# EAGLE schematic Apollo4-BluePlus-Module_rev_a-v33 (EAGLE 9.7.0)
AUTHOR: Pat Pannuto; REV: A; TITLE: Apollo4-BluePlus-Module

## Sheet 1 of 2: Apollo4 IC
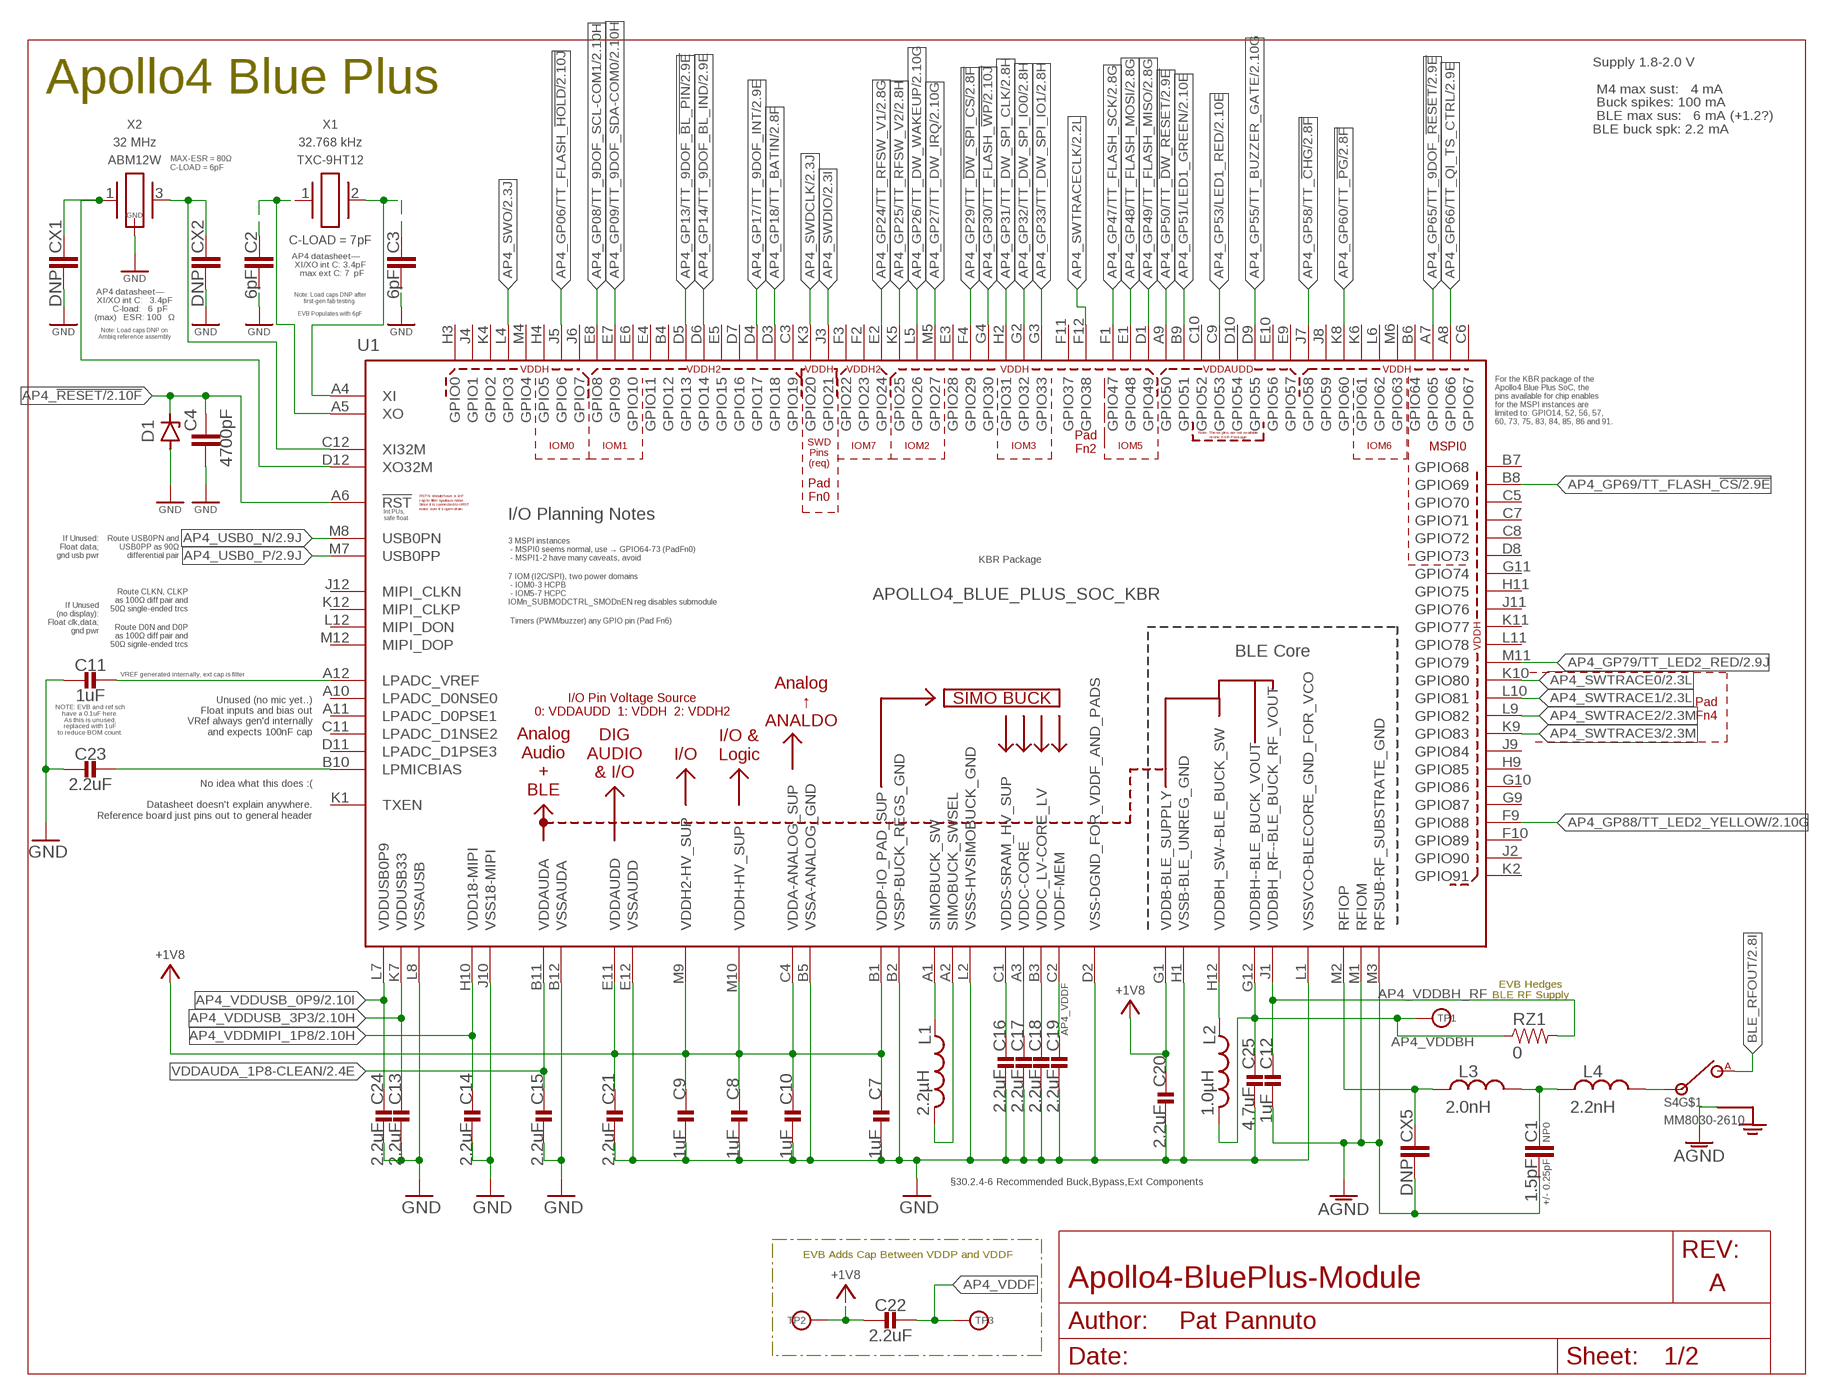
[diagram p0: schematic, sheet 1]

### Parts
C1  1.5pF  C_CHIP-0402(1005-METRIC)  [CAPC1005X60]
C2  6pF  C_CHIP-0402(1005-METRIC)  [CAPC1005X60]
C3  6pF  C_CHIP-0402(1005-METRIC)  [CAPC1005X60]
C4  4700pF  C_CHIP-0402(1005-METRIC)  [CAPC1005X60]
C7  1uF  CAPACITOR0201_CAP  [0201_CAP]
C8  1uF  CAPACITOR0201_CAP  [0201_CAP]
C9  1uF  CAPACITOR0201_CAP  [0201_CAP]
C10  1uF  CAPACITOR0201_CAP  [0201_CAP]
C11  1uF  CAPACITOR0201_CAP  [0201_CAP]
C12  1uF  CAPACITOR0201_CAP  [0201_CAP]
C13  2.2uF  CAPACITOR0201_CAP  [0201_CAP]
C14  2.2uF  CAPACITOR0201_CAP  [0201_CAP]
C15  2.2uF  CAPACITOR0201_CAP  [0201_CAP]
C16  2.2uF  CAPACITOR0201_CAP  [0201_CAP]
C17  2.2uF  CAPACITOR0201_CAP  [0201_CAP]
C18  2.2uF  CAPACITOR0201_CAP  [0201_CAP]
C19  2.2uF  CAPACITOR0201_CAP  [0201_CAP]
C20  2.2uF  CAPACITOR0201_CAP  [0201_CAP]
C21  2.2uF  CAPACITOR0201_CAP  [0201_CAP]
C22  2.2uF  CAPACITOR0201_CAP  [0201_CAP]
C23  2.2uF  CAPACITOR0201_CAP  [0201_CAP]
C24  2.2uF  CAPACITOR0201_CAP  [0201_CAP]
C25  4.7uF  CAPACITOR0402_CAP  [0402_CAP]
CX1  DNP  C_CHIP-0402(1005-METRIC)  [CAPC1005X60]
CX2  DNP  C_CHIP-0402(1005-METRIC)  [CAPC1005X60]
CX5  DNP  C_CHIP-0402(1005-METRIC)  [CAPC1005X60]
D1  ZENER  ZENER_SODFL(1608-METRIC)  [SODFL1608X70]
L1  2.2µH  INDUCTOR0805  [0805_CAP]
L2  1.0µH  INDUCTOR0603  [0603_CAP]
L3  2.0nH  L_CHIP-0402(1006-METRIC)  [INDC1006X60N]
L4  2.2nH  L_CHIP-0402(1006-METRIC)  [INDC1006X60N]
RZ1  0  RESISTOR0402_RES  [0402_RES]
S4  MM8030-2610  [MM8030-2610]
TP1  VDDBH  TEST-POINT  [PAD.03X.03]
TP2  VDDP  TEST-POINT  [PAD.03X.03]
TP3  VDDF  TEST-POINT  [PAD.03X.03]
U1  APOLLO4_BLUE_PLUS_SOC_KBR  [APOLLO4_BLUE_SOC_BGA]
X1  TXC-9HT12  [TXC-9HT12]
X2  ABM12W  [ABM12W]

### Nets
+1V8: C7.P$1 C8.P$1 C9.P$1 C10.P$1 C20.P$1 C21.P$1 C22.P$2 TP2.P$1(TESTPOINT) U1.B1(VDDP-IO_PAD_SUP) U1.C4(VDDA-ANALOG_SUP) U1.E11(VDDAUDD) U1.G1(VDDB-BLE_SUPPLY) U1.M9(VDDH2-HV_SUP) U1.M10(VDDH-HV_SUP) ; also sheet 2
AGND: C1.2 C12.P$2 CX5.2 S4.G1(GND) S4.G2(GND) U1.M1(RFIOM) U1.M3(RFSUB-RF_SUBSTRATE_GND) ; also sheet 2
AP4_!RESET: C4.1 D1.1(C) U1.A6(!RST) ; also sheet 2
AP4_GP06/TT_FLASH_!HOLD: U1.J5(GPIO6) ; also sheet 2
AP4_GP08/TT_9DOF_SCL-COM1: U1.E8(GPIO8) ; also sheet 2
AP4_GP09/TT_9DOF_SDA-COM0: U1.E7(GPIO9) ; also sheet 2
AP4_GP13/TT_9DOF_!BL_PIN: U1.D5(GPIO13) ; also sheet 2
AP4_GP14/TT_9DOF_BL_IND: U1.D6(GPIO14) ; also sheet 2
AP4_GP17/TT_9DOF_INT: U1.D4(GPIO17) ; also sheet 2
AP4_GP18/TT_BATIN: U1.D3(GPIO18) ; also sheet 2
AP4_GP24/TT_RFSW_V1: U1.E2(GPIO24) ; also sheet 2
AP4_GP25/TT_RFSW_V2: U1.K5(GPIO25) ; also sheet 2
AP4_GP26/TT_DW_WAKEUP: U1.L5(GPIO26) ; also sheet 2
AP4_GP27/TT_DW_IRQ: U1.M5(GPIO27) ; also sheet 2
AP4_GP29/TT_!DW_SPI_CS: U1.F4(GPIO29) ; also sheet 2
AP4_GP30/TT_FLASH_!WP: U1.G4(GPIO30) ; also sheet 2
AP4_GP31/TT_DW_SPI_CLK: U1.H2(GPIO31) ; also sheet 2
AP4_GP32/TT_DW_SPI_IO0: U1.G2(GPIO32) ; also sheet 2
AP4_GP33/TT_DW_SPI_IO1: U1.G3(GPIO33) ; also sheet 2
AP4_GP47/TT_FLASH_SCK: U1.F1(GPIO47) ; also sheet 2
AP4_GP48/TT_FLASH_MOSI: U1.E1(GPIO48) ; also sheet 2
AP4_GP49/TT_FLASH_MISO: U1.D1(GPIO49) ; also sheet 2
AP4_GP50/TT_!DW_RESET: U1.A9(GPIO50) ; also sheet 2
AP4_GP51/LED1_GREEN: U1.B9(GPIO51) ; also sheet 2
AP4_GP53/LED1_RED: U1.C9(GPIO53) ; also sheet 2
AP4_GP55/TT_BUZZER_GATE: U1.D9(GPIO55) ; also sheet 2
AP4_GP58/TT_!CHG: U1.J7(GPIO58) ; also sheet 2
AP4_GP60/TT_!PG: U1.K8(GPIO60) ; also sheet 2
AP4_GP65/TT_9DOF_!RESET: U1.A7(GPIO65) ; also sheet 2
AP4_GP66/TT_QI_TS_CTRL: U1.A8(GPIO66) ; also sheet 2
AP4_GP69/TT_FLASH_!CS: U1.B8(GPIO69) ; also sheet 2
AP4_GP79/TT_LED2_RED: U1.M11(GPIO79) ; also sheet 2
AP4_GP88/TT_LED2_YELLOW: U1.F9(GPIO88) ; also sheet 2
AP4_LPADC_VREF: C11.P$2 U1.A12(LPADC_VREF)
AP4_LPMICBIAS: C23.P$2 U1.B10(LPMICBIAS)
AP4_RFIOP [BLE_PHY]: CX5.1 L3.1 U1.M2(RFIOP)
AP4_SWDCLK: U1.K3(GPIO20) ; also sheet 2
AP4_SWDIO: U1.J3(GPIO21) ; also sheet 2
AP4_SWO: U1.L4(GPIO3) ; also sheet 2
AP4_SWTRACE0: U1.K10(GPIO80) ; also sheet 2
AP4_SWTRACE1: U1.L10(GPIO81) ; also sheet 2
AP4_SWTRACE2: U1.L9(GPIO82) ; also sheet 2
AP4_SWTRACE3: U1.K9(GPIO83) ; also sheet 2
AP4_SWTRACECLK: U1.F12(GPIO38) ; also sheet 2
AP4_USB0_N [USB_PHY]: U1.M8(USB0PN) ; also sheet 2
AP4_USB0_P [USB_PHY]: U1.M7(USB0PP) ; also sheet 2
AP4_VDDBH: C25.1 L2.2 RZ1.1 TP1.P$1(TESTPOINT) U1.G12(VDDBH--BLE_BUCK_VOUT)
AP4_VDDBH_RF: C12.P$1 RZ1.2 U1.J1(VDDBH_RF--BLE_BUCK_RF_VOUT)
AP4_VDDBH_SW: L2.1 U1.H12(VDDBH_SW--BLE_BUCK_SW)
AP4_VDDC: C17.P$1 U1.A3(VDDC-CORE)
AP4_VDDC_LV: C18.P$1 U1.B3(VDDC_LV-CORE_LV)
AP4_VDDF: C19.P$1 C22.P$1 TP3.P$1(TESTPOINT) U1.C2(VDDF-MEM)
AP4_VDDMIPI_1P8: C14.P$1 U1.H10(VDD18-MIPI) ; also sheet 2
AP4_VDDS: C16.P$1 U1.C1(VDDS-SRAM_HV_SUP)
AP4_VDDUSB_0P9: C24.P$1 U1.L7(VDDUSB0P9) ; also sheet 2
AP4_VDDUSB_3P3: C13.P$1 U1.K7(VDDUSB33) ; also sheet 2
AP4_XI: C3.1 U1.A4(XI) X1.2
AP4_XI32M: CX2.1 U1.C12(XI32M) X2.3
AP4_XO: C2.1 U1.A5(XO) X1.1
AP4_XO32M: CX1.1 U1.D12(XO32M) X2.1
BLE_RFOUT [BLE_PHY]: S4.OUT(A) ; also sheet 2
GND: C2.2 C3.2 C4.2 C7.P$2 C8.P$2 C9.P$2 C10.P$2 C11.P$1 C13.P$2 C14.P$2 C15.P$2 C16.P$2 C17.P$2 C18.P$2 C19.P$2 C20.P$2 C21.P$2 C23.P$1 C24.P$2 C25.2 CX1.2 CX2.2 D1.2(A) U1.B2(VSSP-BUCK_REGS_GND) U1.B5(VSSA-ANALOG_GND) U1.B12(VSSAUDA) U1.D2(VSS-DGND_FOR_VDDF_AND_PADS) U1.E12(VSSAUDD) U1.H1(VSSB-BLE_UNREG_GND) U1.J10(VSS18-MIPI) U1.L1(VSSVCO-BLECORE_GND_FOR_VCO) U1.L2(VSSS-HVSIMOBUCK_GND) U1.L8(VSSAUSB) X2.2(GND) X2.4(GND) ; also sheet 2
N$17 [BLE_PHY]: C1.1 L3.2 L4.1
N$18 [BLE_PHY]: L4.2 S4.IN
SIMOBUCK_SW: L1.P$1 U1.A1(SIMOBUCK_SW)
SIMOBUCK_SWSEL: L1.P$2 U1.A2(SIMOBUCK_SWSEL)
VDDAUDA_1P8-CLEAN: C15.P$1 U1.B11(VDDAUDA) ; also sheet 2
Unconnected: U1.A10(LPADC_D0NSE0) U1.A11(LPADC_D0PSE1) U1.B4(GPIO12) U1.B6(GPIO64) U1.B7(GPIO68) U1.C3(GPIO19) U1.C5(GPIO70) U1.C6(GPIO67) U1.C7(GPIO71) U1.C8(GPIO72) U1.C10(GPIO52) U1.C11(LPADC_D1NSE2) U1.D7(GPIO16) U1.D8(GPIO73) U1.D10(GPIO54) U1.D11(LPADC_D1PSE3) U1.E3(GPIO28) U1.E4(GPIO11) U1.E5(GPIO15) U1.E6(GPIO10) U1.E9(GPIO57) U1.E10(GPIO56) U1.F2(GPIO23) U1.F3(GPIO22) U1.F10(GPIO89) U1.F11(GPIO37) U1.G9(GPIO87) U1.G10(GPIO86) U1.G11(GPIO74) U1.H3(GPIO0) U1.H4(GPIO5) U1.H9(GPIO85) U1.H11(GPIO75) U1.J2(GPIO90) U1.J4(GPIO1) U1.J6(GPIO7) U1.J8(GPIO59) U1.J9(GPIO84) U1.J11(GPIO76) U1.J12(MIPI_CLKN) U1.K1(TXEN) U1.K2(GPIO91) U1.K4(GPIO2) U1.K6(GPIO61) U1.K11(GPIO77) U1.K12(MIPI_CLKP) U1.L6(GPIO62) U1.L11(GPIO78) U1.L12(MIPI_DON) U1.M4(GPIO4) U1.M6(GPIO63) U1.M12(MIPI_DOP)

### Notes on the sheet
- Apollo4 Blue Plus
- Supply 1.8-2.0 V
  
   M4 max sust:   4 mA
   Buck spikes: 100 mA
   BLE max sus:   6 mA (+1.2?)
  BLE buck spk: 2.2 mA
- AP4 datasheet—    
  XI/XO int C: 3.4pF
    max ext C: 7  pF
- AP4 datasheet—    
  XI/XO int C:   3.4pF
       C-load:   6  pF
  (max)   ESR: 100   Ω
- Note: Load caps DNP after
  first-gen fab testing.
  
  EVB Populates with 6pF
- Note: Load caps DNP on
  Ambiq reference assembly
- For the KBR package of the
  Apollo4 Blue Plus SoC, the
  pins available for chip enables
  for the MSPI instances are
  limited to: GPIO14, 52, 56, 57,
  60, 73, 75, 83, 84, 85, 86 and 91.
- Pad
  Fn2
- MSPI0
- IOM0 | IOM1 | IOM7 | IOM2 | IOM3 | IOM5 | IOM6
- SWD
  Pins
  (req)
- Pad
  Fn0
- Int PUs,
  safe float
- I/O Planning Notes
- 3 MSPI instances
   - MSPI0 seems normal, use → GPIO64-73 (PadFn0)
   - MSPI1-2 have many caveats, avoid
- If Unused:
  Float data;
  gnd usb pwr
- Route USB0PN and
  USB0PP as 90Ω
  differential pair
- KBR Package
- 7 IOM (I2C/SPI), two power domains
   - IOM0-3 HCPB
   - IOM5-7 HCPC
  IOMn_SUBMODCTRL_SMODnEN reg disables submodule
- Route CLKN, CLKP
  as 100Ω diff pair and
  50Ω single-ended trcs
- If Unused
  (no display):
  Float clk,data;
  gnd pwr
- Timers (PWM/buzzer) any GPIO pin (Pad Fn6)
- Route D0N and D0P
  as 100Ω diff pair and
  50Ω signle-ended trcs
- VREF generated internally, ext cap is filter
- NOTE: EVB and ref sch
  have a 0.1uF here.
  As this is unused,
  replaced with 1uF
  to reduce BOM count.
- Pad
  Fn4
- Unused (no mic yet..)
  Float inputs and bias out
  VRef always gen'd internally
  and expects 100nF cap
- No idea what this does :(
  
  Datasheet doesn't explain anywhere.
  Reference board just pins out to general header
- EVB Hedges
  BLE RF Supply
- §30.2.4-6 Recommended Buck,Bypass,Ext Components
- EVB Adds Cap Between VDDP and VDDF

## Sheet 2 of 2: Support Circuits
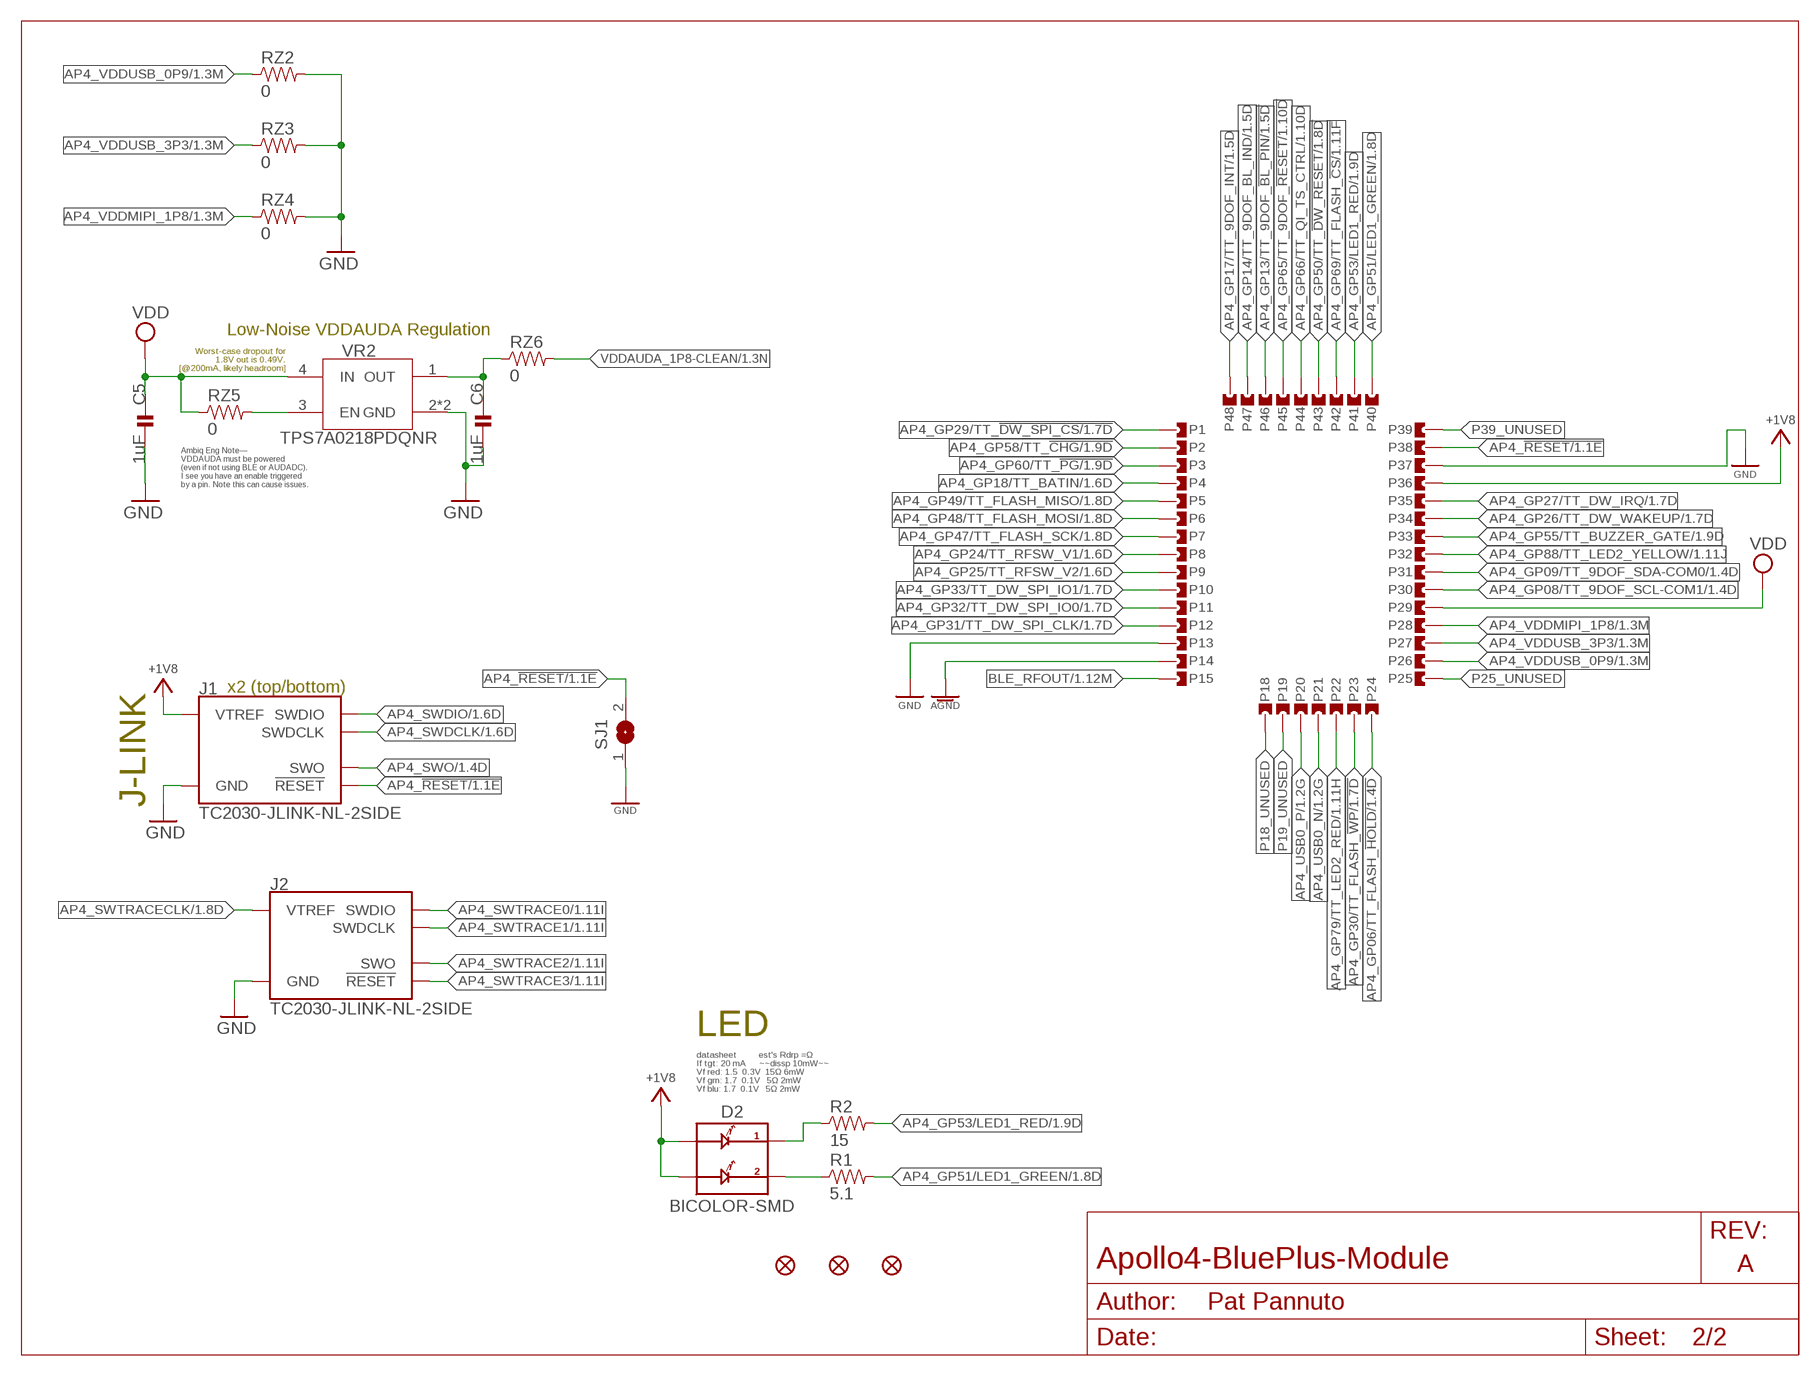
[diagram p1: schematic, sheet 2]

### Parts
C5  1uF  CAPACITOR0201_CAP  [0201_CAP]
C6  1uF  CAPACITOR0201_CAP  [0201_CAP]
D2  BICOLOR-SMD  [LED-0606]
FD1  FIDUCIALUFIDUCIAL  [FIDUCIAL-MICRO]
FD2  FIDUCIALUFIDUCIAL  [FIDUCIAL-MICRO]
FD3  FIDUCIALUFIDUCIAL  [FIDUCIAL-MICRO]
J1  TC2030-JLINK-NL-2SIDE  [TC2030-IDC-NL-2SIDE]
J2  TC2030-JLINK-NL-2SIDE  [TC2030-IDC-NL-2SIDE]
P1  CASTELLATION4L  [CASTELLATION-0.55MM_DRILL-4L]
P2  CASTELLATION4L  [CASTELLATION-0.55MM_DRILL-4L]
P3  CASTELLATION4L  [CASTELLATION-0.55MM_DRILL-4L]
P4  CASTELLATION4L  [CASTELLATION-0.55MM_DRILL-4L]
P5  CASTELLATION4L  [CASTELLATION-0.55MM_DRILL-4L]
P6  CASTELLATION4L  [CASTELLATION-0.55MM_DRILL-4L]
P7  CASTELLATION4L  [CASTELLATION-0.55MM_DRILL-4L]
P8  CASTELLATION4L  [CASTELLATION-0.55MM_DRILL-4L]
P9  CASTELLATION4L  [CASTELLATION-0.55MM_DRILL-4L]
P10  CASTELLATION4L  [CASTELLATION-0.55MM_DRILL-4L]
P11  CASTELLATION4L  [CASTELLATION-0.55MM_DRILL-4L]
P12  CASTELLATION4L  [CASTELLATION-0.55MM_DRILL-4L]
P13  CASTELLATION4L  [CASTELLATION-0.55MM_DRILL-4L]
P14  CASTELLATION4L  [CASTELLATION-0.55MM_DRILL-4L]
P15  CASTELLATION4L  [CASTELLATION-0.55MM_DRILL-4L]
P18  CASTELLATION4L  [CASTELLATION-0.55MM_DRILL-4L]
P19  CASTELLATION4L  [CASTELLATION-0.55MM_DRILL-4L]
P20  CASTELLATION4L  [CASTELLATION-0.55MM_DRILL-4L]
P21  CASTELLATION4L  [CASTELLATION-0.55MM_DRILL-4L]
P22  CASTELLATION4L  [CASTELLATION-0.55MM_DRILL-4L]
P23  CASTELLATION4L  [CASTELLATION-0.55MM_DRILL-4L]
P24  CASTELLATION4L  [CASTELLATION-0.55MM_DRILL-4L]
P25  CASTELLATION4L  [CASTELLATION-0.55MM_DRILL-4L]
P26  CASTELLATION4L  [CASTELLATION-0.55MM_DRILL-4L]
P27  CASTELLATION4L  [CASTELLATION-0.55MM_DRILL-4L]
P28  CASTELLATION4L  [CASTELLATION-0.55MM_DRILL-4L]
P29  CASTELLATION4L  [CASTELLATION-0.55MM_DRILL-4L]
P30  CASTELLATION4L  [CASTELLATION-0.55MM_DRILL-4L]
P31  CASTELLATION4L  [CASTELLATION-0.55MM_DRILL-4L]
P32  CASTELLATION4L  [CASTELLATION-0.55MM_DRILL-4L]
P33  CASTELLATION4L  [CASTELLATION-0.55MM_DRILL-4L]
P34  CASTELLATION4L  [CASTELLATION-0.55MM_DRILL-4L]
P35  CASTELLATION4L  [CASTELLATION-0.55MM_DRILL-4L]
P36  CASTELLATION4L  [CASTELLATION-0.55MM_DRILL-4L]
P37  CASTELLATION4L  [CASTELLATION-0.55MM_DRILL-4L]
P38  CASTELLATION4L  [CASTELLATION-0.55MM_DRILL-4L]
P39  CASTELLATION4L  [CASTELLATION-0.55MM_DRILL-4L]
P40  CASTELLATION4L  [CASTELLATION-0.55MM_DRILL-4L]
P41  CASTELLATION4L  [CASTELLATION-0.55MM_DRILL-4L]
P42  CASTELLATION4L  [CASTELLATION-0.55MM_DRILL-4L]
P43  CASTELLATION4L  [CASTELLATION-0.55MM_DRILL-4L]
P44  CASTELLATION4L  [CASTELLATION-0.55MM_DRILL-4L]
P45  CASTELLATION4L  [CASTELLATION-0.55MM_DRILL-4L]
P46  CASTELLATION4L  [CASTELLATION-0.55MM_DRILL-4L]
P47  CASTELLATION4L  [CASTELLATION-0.55MM_DRILL-4L]
P48  CASTELLATION4L  [CASTELLATION-0.55MM_DRILL-4L]
R1  5.1  RESISTOR0201_RES  [0201_RES]
R2  15  RESISTOR0201_RES  [0201_RES]
RZ2  0  RESISTOR0402_RES  [0402_RES]
RZ3  0  RESISTOR0402_RES  [0402_RES]
RZ4  0  RESISTOR0402_RES  [0402_RES]
RZ5  0  RESISTOR0402_RES  [0402_RES]
RZ6  0  RESISTOR0402_RES  [0402_RES]
SJ1  SJ  [SJ]
VR2  TPS7A0218PDQNR  [4-XDFN-EP]

### Nets
+1V8: D2.A1 D2.A2 J1.1(VTREF) J1.B1(VTREF) P36.P$1 P36.P$2 P36.P$3 ; also sheet 1
AGND: P14.P$1 P14.P$2 P14.P$3 ; also sheet 1
AP4_!RESET: J1.3(!RESET) J1.B3(!RESET) P38.P$1 P38.P$2 P38.P$3 SJ1.2 ; also sheet 1
AP4_GP06/TT_FLASH_!HOLD: P24.P$1 P24.P$2 P24.P$3 ; also sheet 1
AP4_GP08/TT_9DOF_SCL-COM1: P30.P$1 P30.P$2 P30.P$3 ; also sheet 1
AP4_GP09/TT_9DOF_SDA-COM0: P31.P$1 P31.P$2 P31.P$3 ; also sheet 1
AP4_GP13/TT_9DOF_!BL_PIN: P46.P$1 P46.P$2 P46.P$3 ; also sheet 1
AP4_GP14/TT_9DOF_BL_IND: P47.P$1 P47.P$2 P47.P$3 ; also sheet 1
AP4_GP17/TT_9DOF_INT: P48.P$1 P48.P$2 P48.P$3 ; also sheet 1
AP4_GP18/TT_BATIN: P4.P$1 P4.P$2 P4.P$3 ; also sheet 1
AP4_GP24/TT_RFSW_V1: P8.P$1 P8.P$2 P8.P$3 ; also sheet 1
AP4_GP25/TT_RFSW_V2: P9.P$1 P9.P$2 P9.P$3 ; also sheet 1
AP4_GP26/TT_DW_WAKEUP: P34.P$1 P34.P$2 P34.P$3 ; also sheet 1
AP4_GP27/TT_DW_IRQ: P35.P$1 P35.P$2 P35.P$3 ; also sheet 1
AP4_GP29/TT_!DW_SPI_CS: P1.P$1 P1.P$2 P1.P$3 ; also sheet 1
AP4_GP30/TT_FLASH_!WP: P23.P$1 P23.P$2 P23.P$3 ; also sheet 1
AP4_GP31/TT_DW_SPI_CLK: P12.P$1 P12.P$2 P12.P$3 ; also sheet 1
AP4_GP32/TT_DW_SPI_IO0: P11.P$1 P11.P$2 P11.P$3 ; also sheet 1
AP4_GP33/TT_DW_SPI_IO1: P10.P$1 P10.P$2 P10.P$3 ; also sheet 1
AP4_GP47/TT_FLASH_SCK: P7.P$1 P7.P$2 P7.P$3 ; also sheet 1
AP4_GP48/TT_FLASH_MOSI: P6.P$1 P6.P$2 P6.P$3 ; also sheet 1
AP4_GP49/TT_FLASH_MISO: P5.P$1 P5.P$2 P5.P$3 ; also sheet 1
AP4_GP50/TT_!DW_RESET: P43.P$1 P43.P$2 P43.P$3 ; also sheet 1
AP4_GP51/LED1_GREEN: P40.P$1 P40.P$2 P40.P$3 R1.2 ; also sheet 1
AP4_GP53/LED1_RED: P41.P$1 P41.P$2 P41.P$3 R2.2 ; also sheet 1
AP4_GP55/TT_BUZZER_GATE: P33.P$1 P33.P$2 P33.P$3 ; also sheet 1
AP4_GP58/TT_!CHG: P2.P$1 P2.P$2 P2.P$3 ; also sheet 1
AP4_GP60/TT_!PG: P3.P$1 P3.P$2 P3.P$3 ; also sheet 1
AP4_GP65/TT_9DOF_!RESET: P45.P$1 P45.P$2 P45.P$3 ; also sheet 1
AP4_GP66/TT_QI_TS_CTRL: P44.P$1 P44.P$2 P44.P$3 ; also sheet 1
AP4_GP69/TT_FLASH_!CS: P42.P$1 P42.P$2 P42.P$3 ; also sheet 1
AP4_GP79/TT_LED2_RED: P22.P$1 P22.P$2 P22.P$3 ; also sheet 1
AP4_GP88/TT_LED2_YELLOW: P32.P$1 P32.P$2 P32.P$3 ; also sheet 1
AP4_LED2_BLUE_COMM: D2.C1 R2.1
AP4_LED_RED_COMM: D2.C2 R1.1
AP4_SWDCLK: J1.4(SWDCLK) J1.B4(SWDCLK) ; also sheet 1
AP4_SWDIO: J1.2(SWDIO) J1.B2(SWDIO) ; also sheet 1
AP4_SWO: J1.6(SWO) J1.B6(SWO) ; also sheet 1
AP4_SWTRACE0: J2.2(SWDIO) J2.B2(SWDIO) ; also sheet 1
AP4_SWTRACE1: J2.4(SWDCLK) J2.B4(SWDCLK) ; also sheet 1
AP4_SWTRACE2: J2.6(SWO) J2.B6(SWO) ; also sheet 1
AP4_SWTRACE3: J2.3(!RESET) J2.B3(!RESET) ; also sheet 1
AP4_SWTRACECLK: J2.1(VTREF) J2.B1(VTREF) ; also sheet 1
AP4_USB0_N [USB_PHY]: P21.P$1 P21.P$2 P21.P$3 ; also sheet 1
AP4_USB0_P [USB_PHY]: P20.P$1 P20.P$2 P20.P$3 ; also sheet 1
AP4_VDDMIPI_1P8: P28.P$1 P28.P$2 P28.P$3 RZ4.1 ; also sheet 1
AP4_VDDUSB_0P9: P26.P$1 P26.P$2 P26.P$3 RZ2.1 ; also sheet 1
AP4_VDDUSB_3P3: P27.P$1 P27.P$2 P27.P$3 RZ3.1 ; also sheet 1
BLE_RFOUT [BLE_PHY]: P15.P$1 P15.P$2 P15.P$3 ; also sheet 1
GND: C5.P$2 C6.P$2 J1.5(GND) J1.B5(GND) J2.5(GND) J2.B5(GND) P13.P$1 P13.P$2 P13.P$3 P37.P$1 P37.P$2 P37.P$3 RZ2.2 RZ3.2 RZ4.2 SJ1.1 VR2.2(GND) VR2.PAD(GND) ; also sheet 1
P18_UNUSED: P18.P$1 P18.P$2 P18.P$3
P19_UNUSED: P19.P$1 P19.P$2 P19.P$3
P25_UNUSED: P25.P$1 P25.P$2 P25.P$3
P39_UNUSED: P39.P$1 P39.P$2 P39.P$3
VDD: C5.P$1 P29.P$1 P29.P$2 P29.P$3 RZ5.1 VR2.4(IN)
VDDAUDA_1P8-CLEAN: RZ6.2 ; also sheet 1
VR2_EN: RZ5.2 VR2.3(EN)
VR2_OUT: C6.P$1 RZ6.1 VR2.1(OUT)

### Notes on the sheet
- Low-Noise VDDAUDA Regulation
- Worst-case dropout for
  1.8V out is 0.49V.
  [@200mA, likely headroom]
- Ambiq Eng Note—
  VDDAUDA must be powered
  (even if not using BLE or AUDADC).
  I see you have an enable triggered
  by a pin. Note this can cause issues.
- x2 (top/bottom)
- J-LINK
- LED
- datasheet          est's Rdrp =Ω
  If tgt: 20 mA      ~~dissp 10mW~~
  Vf red: 1.5  0.3V  15Ω 6mW
  Vf grn: 1.7  0.1V   5Ω 2mW
  Vf blu: 1.7  0.1V   5Ω 2mW

## Library data of the parts
C1 = Capacitor:C: Capacitor - Generic; CATEGORY: Capacitor; DESCRIPTION: CAP CER 1.5PF 50V C0G/NP0 0402; MANUFACTURER: KEMET; MPN: C0402C159C5GAC7867; TEMPCOEFF: NP0; TOLERANCE: +/- 0.25pF
C2 C3 = Capacitor:C: Capacitor - Generic; CATEGORY: Capacitor; MANUFACTURER: Murata; MPN: GCM1555C1H6R0BA16D
C4 = Capacitor:C: Capacitor - Generic; CATEGORY: Capacitor; MPN: KGM05AR71E472KH
C5-C10 C12 = passives:CAPACITOR: SMD Capacitor; MANUFACTURER: Murata; MPN: GRM033R61A105ME44D
C11 = passives:CAPACITOR: SMD Capacitor; MANUFACTURER: MURATA; MPN: GRM033R61A105ME44D
C13-C24 = passives:CAPACITOR: SMD Capacitor; MANUFACTURER: Murata; MPN: GRM033R61A225KE47D
C25 = passives:CAPACITOR: SMD Capacitor; MPN: CL05A475MP5NRNC
CX1 CX2 CX5 = Capacitor:C: Capacitor - Generic; CATEGORY: Capacitor
D1 = Diode:ZENER: Zener Diode - Generic; CATEGORY: Diode; DESCRIPTION: DIODE TVS 5.5V STANDOFF 8V BREAKDOWN SC79; MANUFACTURER: NXP SEMICONDUCTOR; MPN: PESD5V0X1UB,135; SUB-CATEGORY: Zener
D2 = leds:BICOLOR-SMD; MPN: MCL0606FRD1GR1T
FD1-FD3 = SparkFun-Aesthetics:FIDUCIAL: Fiducial Alignment Points Point-of-reference for pick-and-place machines and other optical instruments.
J1 J2 = connector:TC2030-JLINK
L1 = passives:INDUCTOR: A very specific inductor; MANUFACTURER: Murata; MPN: DFE201210U-2R2M=P2
L2 = passives:INDUCTOR: A very specific inductor; MANUFACTURER: Murata; MPN: DFE18SAN1R0ME0L
L3 = Inductor:L: Inductor Fixed - Generic; CATEGORY: Inductor; DESCRIPTION: FIXED IND 2.0NH0.1NH SMD; MANUFACTURER: Central Technologies; MPN: CTTF0402F-2N0B; SUB-CATEGORY: Fixed; TOLERANCE: +/- 0.1 nH
L4 = Inductor:L: Inductor Fixed - Generic; CATEGORY: Inductor; DESCRIPTION: FIXED IND 2.2NH0.1NH SMD; MANUFACTURER: Central Technologies; MPN: CTTF0402F-2N2B; SUB-CATEGORY: Fixed; TOLERANCE: +/- 0.1 nH
P1-P15 P18-P48 = connector:CASTELLATION: Castellation 0.55 mm drill, 1.27 mm pitch – Matches ESP32
R1 = passives:RESISTOR: Resistor Basic schematic elements and footprints for 0201, 0402, 0603, 1206, and PTH resistors.; MPN: SR731HTTC5R10F; PDISS: 0.002 W
R2 = passives:RESISTOR: Resistor Basic schematic elements and footprints for 0201, 0402, 0603, 1206, and PTH resistors.; DESCRIPTION: RES SMD 15 OHM 5% 1/20W 0201; MPN: ERJ-1GNJ150C; PDISS: 0.006 W
RZ1-RZ6 = passives:RESISTOR: Resistor Basic schematic elements and footprints for 0201, 0402, 0603, 1206, and PTH resistors.; MPN: RMCF0402ZT0R00; SUBSTITUE: Any
S4 = switches:MM8030-2610; DURABILITY: 100 Cycles; FREQ-MAX: 11 GHz; MANUFACTURER: Murata; MPN: MM8030-2610
SJ1 = jumper:SJ: SMD solder JUMPER
TP1-TP3 = headers:TEST-POINT
U1 = Quorvo:APOLLO4_BLUE_PLUS_SOC_KBR
VR2 = regulators:TPS7A02; MPN: TPS7A0218PDQNR
X1 = crystals:TXC-9HT12; C-LOAD: 7pF; FREQUENCY: 32.768 kHz; MANUFACTURER: TXC Corp; MPN: 9HT12-32.768KDZY-T
X2 = crystals:ABM12W; C-LOAD: 6pF; FREQUENCY: 32 MHz; MANUFACTURER: Abracon; MAX-ESR: 80Ω; MPN: ABM12W-32.0000MHZ-6-D1X-T3

## Net classes
1 USB_PHY: width 0.152 mm, clearance 0.305 mm
2 BLE_PHY: width 0.203 mm, clearance 0.095 mm